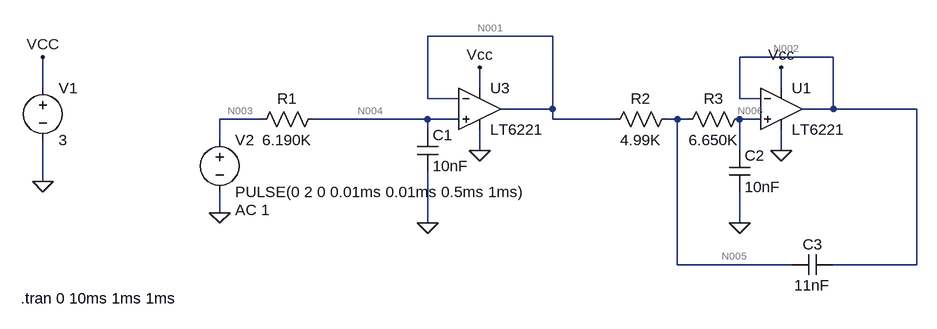
[diagram p0: schematic LPF 1KHz.asc]
* LPF 1KHz.asc
R1 N004 N003 6.190K
V1 VCC 0 3
V2 N003 0 PULSE(0 2 0 0.01ms 0.01ms 0.5ms 1ms) AC 1
C1 N004 0 10nF
R2 N005 N001 4.99K
R3 N006 N005 6.650K
C2 N006 0 10nF
C3 N002 N005 11nF
* U3: LT6221 (symbol Opamps\LT6221 not available, pins judged from their places): In+=N004 In-=N001 V+=VCC V-=0 OUT=N001
* U1: LT6221 (symbol Opamps\LT6221 not available, pins judged from their places): In+=N006 In-=N002 V+=VCC V-=0 OUT=N002
.tran 0 10ms 1ms 1ms
.backanno
.end

* Results of the author's LTspice run, read from the files saved beside the schematic
* Operating Point, zero values left out:
*   V(n004) = 92.75 µV
*   V(vcc) = 3 V
*   V(n005) = 207.7 µV
*   V(n001) = 133 µV
*   V(n006) = 307.4 µV
*   V(n002) = 344.9 µV
*   I(R3) = 14.98 nA
*   I(R2) = 14.98 nA
*   I(R1) = 14.98 nA
*   I(V2) = 14.98 nA
*   I(V1) = -188.9 µA
*   Ix(u3:1) = -14.98 nA
*   Ix(u3:2) = -14.98 nA
*   Ix(u3:3) = 91.42 µA
*   Ix(u3:4) = -91.42 µA
*   Ix(u3:5) = 29.97 nA
*   Ix(u1:1) = -14.98 nA
*   Ix(u1:2) = -14.98 nA
*   Ix(u1:3) = 97.51 µA
*   Ix(u1:4) = -97.49 µA
*   Ix(u1:5) = 14.98 nA
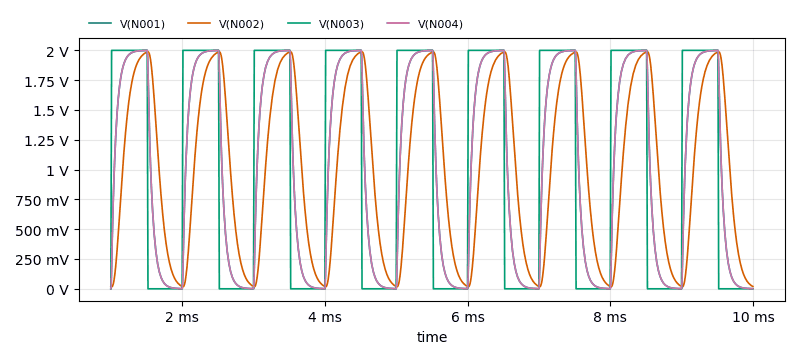
[diagram p1: Transient Analysis of LPF 1KHz.asc, plotted from the saved traces]
* Transient Analysis, 1 run:
*   V(N001): min 858.2 µV, max 2 V, average 1.021 V, rms 1.339 V, last 859.2 µV
*   V(N002): min 17.25 mV, max 1.988 V, average 1.02 V, rms 1.266 V, last 19.67 mV
*   V(N003): min 0 V, max 2 V, average 1.02 V, rms 1.424 V, last 0 V
*   V(N004): min 823.2 µV, max 2 V, average 1.021 V, rms 1.339 V, last 824.2 µV